# EAGLE design odroid_shield (EAGLE 6.5.0)
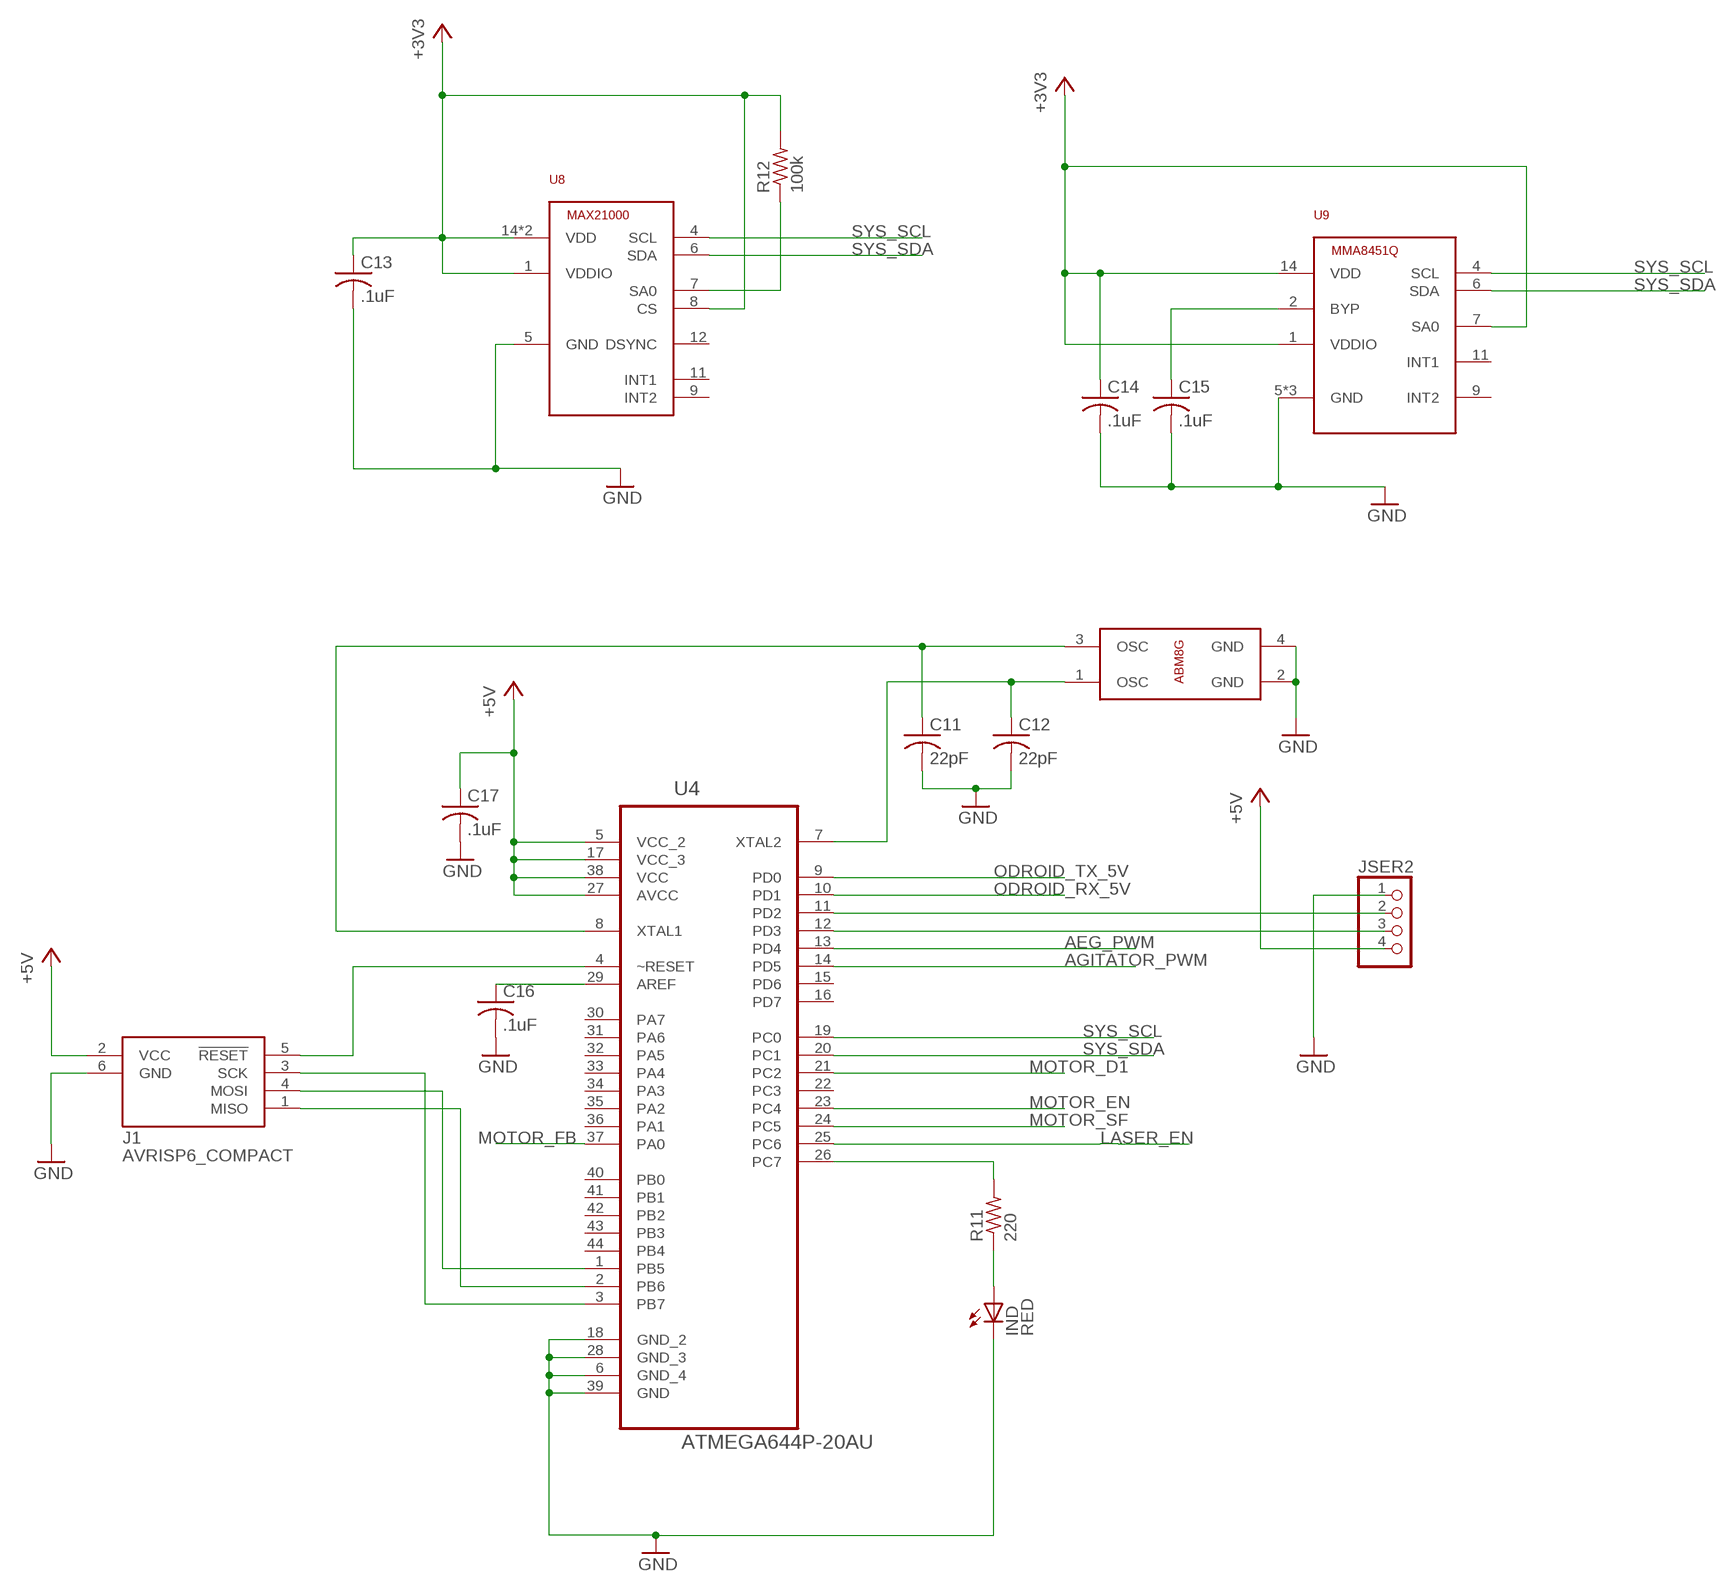
[diagram p0: schematic, sheet 1, part 1 of 2]
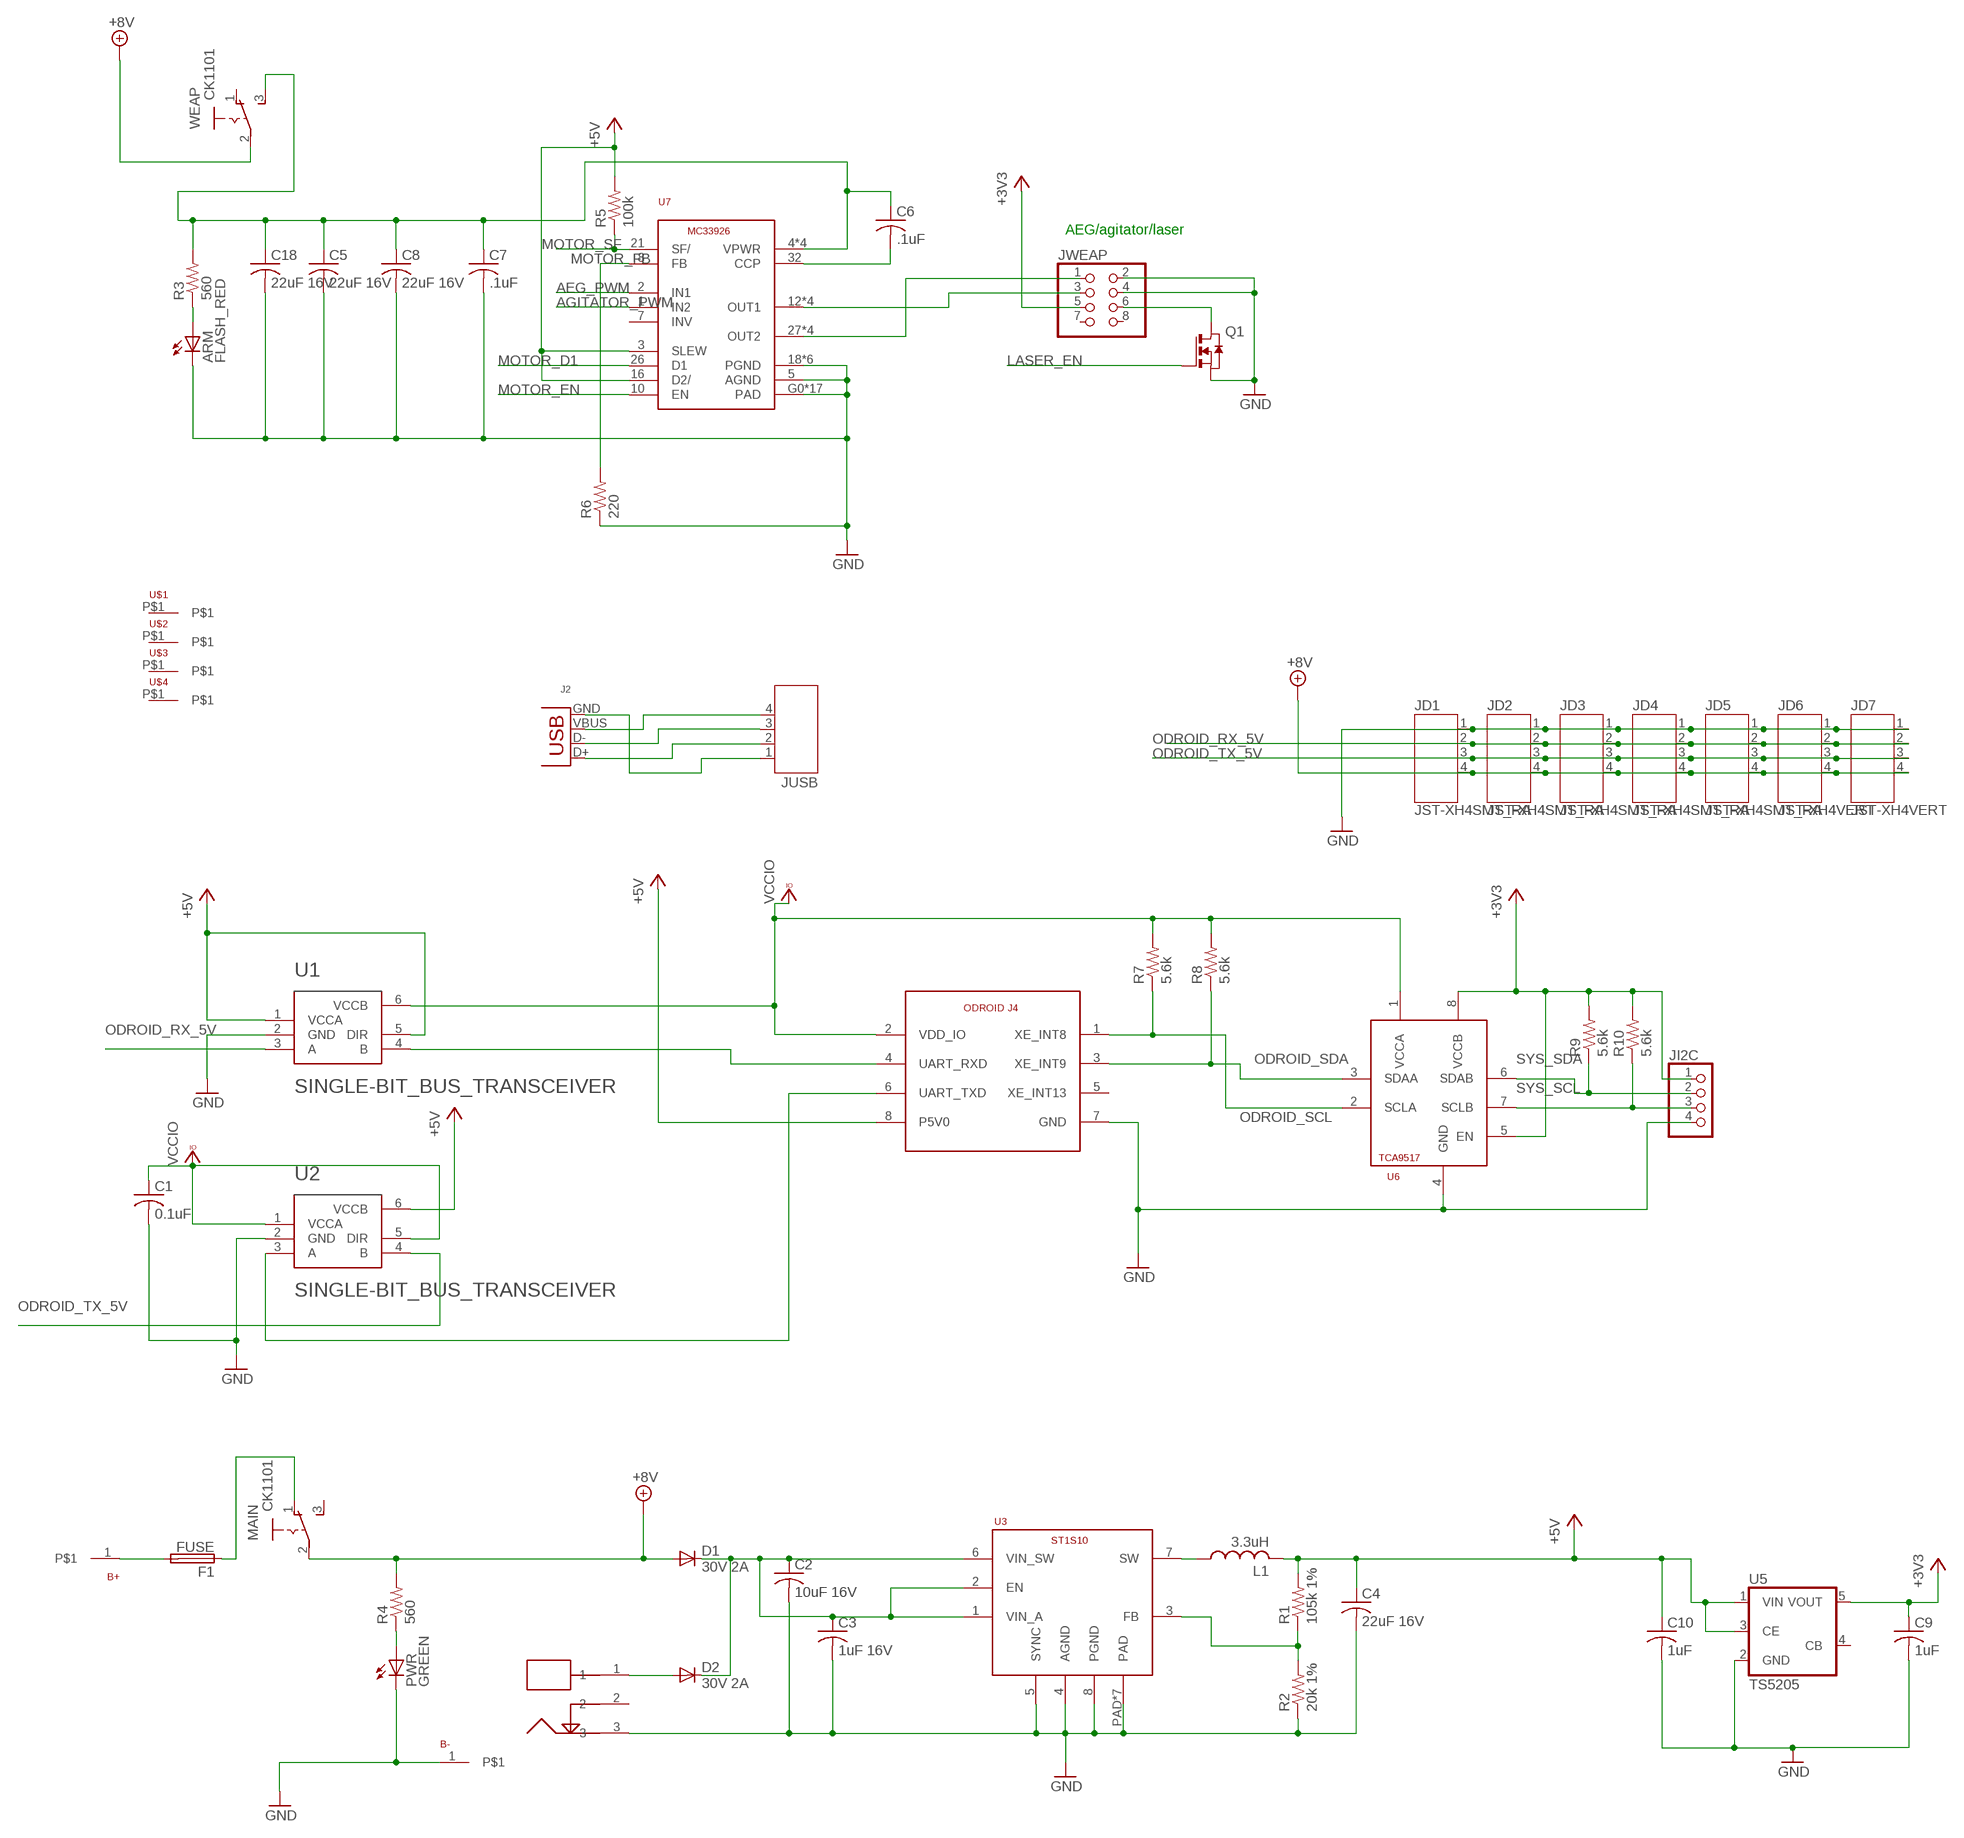
[diagram p1: schematic, sheet 1, part 2 of 2]

## Parts
ARM  FLASH_RED  LED5MM  [LED5MM]
B+  BAT_TERM  [BAT_TERM]
B-  BAT_TERM  [BAT_TERM]
C1  0.1uF  C-USC0603  [C0603]
C2  10uF 16V  C-USC1206  [C1206]
C3  1uF 16V  C-USC0603  [C0603]
C4  22uF 16V  C-USC1210  [C1210]
C5  22uF 16V  C-USC1210  [C1210]
C6  .1uF  C-USC0603  [C0603]
C7  .1uF  C-USC0603  [C0603]
C8  22uF 16V  C-USC1210  [C1210]
C9  1uF  C-USC0603  [C0603]
C10  1uF  C-USC0603  [C0603]
C11  22pF  C-USC0603  [C0603]
C12  22pF  C-USC0603  [C0603]
C13  .1uF  C-USC0603  [C0603]
C14  .1uF  C-USC0603  [C0603]
C15  .1uF  C-USC0603  [C0603]
C16  .1uF  C-USC0603  [C0603]
C17  .1uF  C-USC0603  [C0603]
C18  22uF 16V  C-USC1210  [C1210]
D1  30V 2A  DIODE-CMS06  [CMS06]
D2  30V 2A  DIODE-CMS06  [CMS06]
F1  FUSE  [KEYSTONE_HORIZ_FUSE_CLIP]
IND  RED  LEDCHIPLED_0805  [CHIPLED_0805]
J1  AVRISP6_COMPACT  [CON6P2R]
J2  USB2MM  [1X04/2MM]
J4  ODROID_J4  [2X04/2MM]
JD1  JST-XH4SMT_RA  [JST_XH_SMT_RA_4]
JD2  JST-XH4SMT_RA  [JST_XH_SMT_RA_4]
JD3  JST-XH4SMT_RA  [JST_XH_SMT_RA_4]
JD4  JST-XH4SMT_RA  [JST_XH_SMT_RA_4]
JD5  JST-XH4SMT_RA  [JST_XH_SMT_RA_4]
JD6  JST-XH4VERT  [JST_XH_VERT_4]
JD7  JST-XH4VERT  [JST_XH_VERT_4]
JI2C  PINHD-1X4  [1X04]
JSER2  PINHD-1X4  [1X04]
JUSB  JST-PH4  [JST-PH4]
JWEAP  PINHD-2X4  [2X04]
L1  3.3uH  L-USWURTH_74404042033  [WURTH_74404042033]
MAIN  CK1101  [CK1101C]
PWR  GREEN  LEDCHIPLED_0805  [CHIPLED_0805]
Q1  NMOSSOT23  [SOT-23]
R1  105k 1%  R-US_R0603  [R0603]
R2  20k 1%  R-US_R0603  [R0603]
R3  560  R-US_R0603  [R0603]
R4  560  R-US_R0603  [R0603]
R5  100k  R-US_R0603  [R0603]
R6  220  R-US_R0603  [R0603]
R7  5.6k  R-US_R0603  [R0603]
R8  5.6k  R-US_R0603  [R0603]
R9  5.6k  R-US_R0603  [R0603]
R10  5.6k  R-US_R0603  [R0603]
R11  220  R-US_R0603  [R0603]
R12  100k  R-US_R0603  [R0603]
SHORE  PJ-034ASMT  [CUI_PJ_015AH_SMT]
U1  SINGLE-BIT_BUS_TRANSCEIVER  [SOT23-6]
U2  SINGLE-BIT_BUS_TRANSCEIVER  [SOT23-6]
U3  ST1S10  [POWER_SO8]
U4  ATMEGA644P-20AU  [QFP80P1200X1200X120-44N]
U5  TS5205  [SOT25]
U6  TCA9517MSOP8  [MSOP8]
U7  MC33926  [PQFN32]
U8  MAX21000  [LGA16]
U9  MMA8451Q  [QFN16]
U10  ABM8G  [ABM8G]
U$1  M3_HEX_MOUNT  [M3_HEX_MOUNT]
U$2  M3_HEX_MOUNT  [M3_HEX_MOUNT]
U$3  M3_HEX_MOUNT  [M3_HEX_MOUNT]
U$4  M3_HEX_MOUNT  [M3_HEX_MOUNT]
WEAP  CK1101  [CK1101C]

## Nets
+3V3: C9.1 C13.1 C14.1 JI2C.1 JWEAP.5 R9.2 R10.2 R12.2 U5.5(VOUT) U6.5(EN) U6.8(VCCB) U8.1(VDDIO) U8.8(CS) U8.14(VDD) U8.15(VDD) U9.1(VDDIO) U9.7(SA0) U9.14(VDD)
+5V: C4.1 C10.1 C17.1 J1.2(VCC) J4.8(P5V0) JSER2.4 L1.2 R1.2 R5.2 U1.1(VCCA) U1.5(DIR) U2.6(VCCB) U4.5(VCC_2) U4.17(VCC_3) U4.27(AVCC) U4.38(VCC) U5.1(VIN) U5.3(CE) U7.3(SLEW) U7.16(D2/)
+8V: D1.1(A) JD1.4 JD2.4 JD3.4 JD4.4 JD5.4 JD6.4 JD7.4 MAIN.2(P) R4.2 WEAP.2(P)
AEG_PWM: U4.13(PD4) U7.2(IN1)
AGITATOR_PWM: U4.14(PD5) U7.1(IN2)
GND: ARM.K(C) B-.1 C1.2 C2.2 C3.2 C4.2 C5.2 C7.2 C8.2 C9.2 C10.2 C11.2 C12.2 C13.2 C14.2 C15.2 C16.2 C17.2 C18.2 IND.C J1.6(GND) J4.7(GND) JD1.1 JD2.1 JD3.1 JD4.1 JD5.1 JD6.1 JD7.1 JI2C.4 JSER2.1 JWEAP.2 JWEAP.4 PWR.C Q1.2(S) R2.1 R6.1 SHORE.3 U1.2(GND) U2.2(GND) U3.4(AGND) U3.5(SYNC) U3.8(PGND) U3.PAD U3.PAD1(PAD) U3.PAD2(PAD) U3.PAD3(PAD) U3.PAD4(PAD) U3.PAD5(PAD) U3.PAD6(PAD) U4.6(GND_4) U4.18(GND_2) U4.28(GND_3) U4.39(GND) U5.2(GND) U6.4(GND) U7.5(AGND) U7.18(PGND) U7.19(PGND) U7.20(PGND) U7.22(PGND) U7.23(PGND) U7.24(PGND) U7.G0(PAD) U7.G1(PAD) U7.G2(PAD) U7.G3(PAD) U7.G4(PAD) U7.G5(PAD) U7.G6(PAD) U7.G7(PAD) U7.G8(PAD) U7.G9(PAD) U7.G10(PAD) U7.G11(PAD) U7.G12(PAD) U7.G13(PAD) U7.G14(PAD) U7.G15(PAD) U7.G16(PAD) U8.5(GND) U9.5(GND) U9.10(GND) U9.12(GND) U10.2(GND) U10.4(GND)
LASER_EN: Q1.3(G) U4.25(PC6)
MOTOR_D1: U4.21(PC2) U7.26(D1)
MOTOR_EN: U4.23(PC4) U7.10(EN)
MOTOR_FB: R6.2 U4.37(PA0) U7.8(FB)
MOTOR_SF: R5.1 U4.24(PC5) U7.21(SF/)
N$1: J2.VBUS JUSB.4
N$2: J4.4(UART_RXD) U1.4(B)
N$3: J2.D- JUSB.3
N$4: J4.6(UART_TXD) U2.3(A)
N$5: J2.D+ JUSB.2
N$6: J2.GND JUSB.1
N$7: B+.1 F1.3 F1.4
N$8: F1.1 F1.2 MAIN.1(O)
N$9: D2.1(A) SHORE.1
N$10: L1.1 U3.7(SW)
N$11: C2.1 C3.1 D1.2(C) D2.2(C) U3.1(VIN_A) U3.2(EN) U3.6(VIN_SW)
N$12: JWEAP.1 U7.27(OUT2) U7.28(OUT2) U7.29(OUT2) U7.30(OUT2)
N$13: R1.1 R2.2 U3.3(FB)
N$14: JWEAP.3 U7.12(OUT1) U7.13(OUT1) U7.14(OUT1) U7.15(OUT1)
N$15: C5.1 C6.1 C7.1 C8.1 C18.1 R3.2 U7.4(VPWR) U7.6(VPWR) U7.11(VPWR) U7.31(VPWR) WEAP.3(S)
N$16: C6.2 U7.32(CCP)
N$17: R11.2 U4.26(PC7)
N$18: R12.1 U8.7(SA0)
N$19: JWEAP.6 Q1.1(D)
N$20: ARM.A R3.1
N$21: J1.5(!RESET) U4.4(~RESET)
N$22: PWR.A R4.1
N$23: J1.3(SCK) U4.3(PB7)
N$24: J1.4(MOSI) U4.1(PB5)
N$25: J1.1(MISO) U4.2(PB6)
N$26: JSER2.3 U4.12(PD3)
N$27: JSER2.2 U4.11(PD2)
N$28: IND.A R11.1
N$30: C16.1 U4.29(AREF)
N$32: C12.1 U4.7(XTAL2) U10.1(OSC)
N$33: C11.1 U4.8(XTAL1) U10.3(OSC)
N$36: C15.1 U9.2(BYP)
ODROID_RX_5V: JD1.2 JD2.2 JD3.2 JD4.2 JD5.2 JD6.2 JD7.2 U1.3(A) U4.10(PD1)
ODROID_SCL: J4.1(XE_INT8) R7.1 U6.2(SCLA)
ODROID_SDA: J4.3(XE_INT9) R8.1 U6.3(SDAA)
ODROID_TX_5V: JD1.3 JD2.3 JD3.3 JD4.3 JD5.3 JD6.3 JD7.3 U2.4(B) U4.9(PD0)
SYS_SCL: JI2C.3 R10.1 U4.19(PC0) U6.7(SCLB) U8.4(SCL) U9.4(SCL)
SYS_SDA: JI2C.2 R9.1 U4.20(PC1) U6.6(SDAB) U8.6(SDA) U9.6(SDA)
VCCIO: C1.1 J4.2(VDD_IO) R7.2 R8.2 U1.6(VCCB) U2.1(VCCA) U2.5(DIR) U6.1(VCCA)
Unconnected: J4.5(XE_INT13) JWEAP.7 JWEAP.8 MAIN.3(S) SHORE.2 U4.15(PD6) U4.16(PD7) U4.22(PC3) U4.30(PA7) U4.31(PA6) U4.32(PA5) U4.33(PA4) U4.34(PA3) U4.35(PA2) U4.36(PA1) U4.40(PB0) U4.41(PB1) U4.42(PB2) U4.43(PB3) U4.44(PB4) U5.4(CB) U7.7(INV) U8.9(INT2) U8.11(INT1) U8.12(DSYNC) U9.9(INT2) U9.11(INT1) U$1.P$1 U$2.P$1 U$3.P$1 U$4.P$1 WEAP.1(O)

## Notes on the sheet
- AEG/agitator/laser

## Library data of the parts
ARM = led:LED: LED OSRAM: - CHIPLED LG R971, LG N971, LY N971, LG Q971, LY Q971, LO R971, LY R971 LH N974, LH R974 LS Q976, LO Q976, LY Q976 LO Q996 - Hyper CHIPLED LW Q18S LB Q993, LB Q99A, LB R99A - SideLED LS A670, LO A670, LY A670, LG A670, LP A670 LB A673, LV A673, LT A673, LW A673 LH A674 LY A675 LS A676, LA A676, LO A676, LY A676, LW A676 LS A679, LY A679, LG A679 - Hyper Micro SIDELED® LS Y876, LA Y876, LO Y876, LY Y876 LT Y87S - SmartLED LW L88C, LW L88S LB L89C, LB L89S, LG L890 LS L89K, LO L89K, LY L89K LS L896, LA L896, LO L896, LY L896 - TOPLED LS T670, LO T670, LY T670, LG T670, LP T670 LSG T670, LSP T670, LSY T670, LOP T670, LYG T670 LG T671, LOG T671, LSG T671 LB T673, LV T673, LT T673, LW T673 LH T674 LS T676, LA T676, LO T676, LY T676, LB T676, LH T676, LSB T676, LW T676 LB T67C, LV T67C, LT T67C, LS T67K, LO T67K, LY T67K, LW E67C LS E67B, LA E67B, LO E67B, LY E67B, LB E67C, LV E67C, LT E67C LW T67C LS T679, LY T679, LG T679 LS T770, LO T770, LY T770, LG T770, LP T770 LB T773, LV T773, LT T773, LW T773 LH T774 LS E675, LA E675, LY E675, LS T675 LS T776, LA T776, LO T776, LY T776, LB T776 LHGB T686 LT T68C, LB T68C - Hyper Mini TOPLED® LB M676 - Mini TOPLED Santana® LG M470 LS M47K, LO M47K, LY M47K Source: http://www.osram.convergy.de LUXEON: - LUMILED® LXK2-PW12-R00, LXK2-PW12-S00, LXK2-PW14-U00, LXK2-PW14-V00 LXK2-PM12-R00, LXK2-PM12-S00, LXK2-PM14-U00 LXK2-PE12-Q00, LXK2-PE12-R00, LXK2-PE12-S00, LXK2-PE14-T00, LXK2-PE14-U00 LXK2-PB12-K00, LXK2-PB12-L00, LXK2-PB12-M00, LXK2-PB14-N00, LXK2-PB14-P00, LXK2-PB14-Q00 LXK2-PR12-L00, LXK2-PR12-M00, LXK2-PR14-Q00, LXK2-PR14-R00 LXK2-PD12-Q00, LXK2-PD12-R00, LXK2-PD12-S00 LXK2-PH12-R00, LXK2-PH12-S00 LXK2-PL12-P00, LXK2-PL12-Q00, LXK2-PL12-R00 Source: www.luxeon.com KINGBRIGHT: KA-3528ASYC Source: www.kingbright.com; DPN: 67-1499-ND
B+ B- = odroid_shield:BAT_TERM
C1 C6 C7 C9-C17 = rcl:C-US: CAPACITOR, American symbol
C2 = rcl:C-US: CAPACITOR, American symbol; DPN: 399-7442-1-ND
C3 = rcl:C-US: CAPACITOR, American symbol; DPN: 399-7847-1-ND
C4 C5 C8 C18 = rcl:C-US: CAPACITOR, American symbol; DPN: 445-3955-1-ND
D1 D2 = odroid_shield:DIODE-: DIODE; DPN: CMS06QMCT-ND
F1 = odroid_shield:FUSE: Fuse; DPN: 36-3569-ND
IND PWR = led:LED: LED OSRAM: - CHIPLED LG R971, LG N971, LY N971, LG Q971, LY Q971, LO R971, LY R971 LH N974, LH R974 LS Q976, LO Q976, LY Q976 LO Q996 - Hyper CHIPLED LW Q18S LB Q993, LB Q99A, LB R99A - SideLED LS A670, LO A670, LY A670, LG A670, LP A670 LB A673, LV A673, LT A673, LW A673 LH A674 LY A675 LS A676, LA A676, LO A676, LY A676, LW A676 LS A679, LY A679, LG A679 - Hyper Micro SIDELED® LS Y876, LA Y876, LO Y876, LY Y876 LT Y87S - SmartLED LW L88C, LW L88S LB L89C, LB L89S, LG L890 LS L89K, LO L89K, LY L89K LS L896, LA L896, LO L896, LY L896 - TOPLED LS T670, LO T670, LY T670, LG T670, LP T670 LSG T670, LSP T670, LSY T670, LOP T670, LYG T670 LG T671, LOG T671, LSG T671 LB T673, LV T673, LT T673, LW T673 LH T674 LS T676, LA T676, LO T676, LY T676, LB T676, LH T676, LSB T676, LW T676 LB T67C, LV T67C, LT T67C, LS T67K, LO T67K, LY T67K, LW E67C LS E67B, LA E67B, LO E67B, LY E67B, LB E67C, LV E67C, LT E67C LW T67C LS T679, LY T679, LG T679 LS T770, LO T770, LY T770, LG T770, LP T770 LB T773, LV T773, LT T773, LW T773 LH T774 LS E675, LA E675, LY E675, LS T675 LS T776, LA T776, LO T776, LY T776, LB T776 LHGB T686 LT T68C, LB T68C - Hyper Mini TOPLED® LB M676 - Mini TOPLED Santana® LG M470 LS M47K, LO M47K, LY M47K Source: http://www.osram.convergy.de LUXEON: - LUMILED® LXK2-PW12-R00, LXK2-PW12-S00, LXK2-PW14-U00, LXK2-PW14-V00 LXK2-PM12-R00, LXK2-PM12-S00, LXK2-PM14-U00 LXK2-PE12-Q00, LXK2-PE12-R00, LXK2-PE12-S00, LXK2-PE14-T00, LXK2-PE14-U00 LXK2-PB12-K00, LXK2-PB12-L00, LXK2-PB12-M00, LXK2-PB14-N00, LXK2-PB14-P00, LXK2-PB14-Q00 LXK2-PR12-L00, LXK2-PR12-M00, LXK2-PR14-Q00, LXK2-PR14-R00 LXK2-PD12-Q00, LXK2-PD12-R00, LXK2-PD12-S00 LXK2-PH12-R00, LXK2-PH12-S00 LXK2-PL12-P00, LXK2-PL12-Q00, LXK2-PL12-R00 Source: www.luxeon.com KINGBRIGHT: KA-3528ASYC Source: www.kingbright.com
J1 = odroid_shield:AVRISP6: 6-pin dual-row connector for Atmel AVRISP programmer interface
J2 = odroid_shield:USB: USB Connectors
J4 = odroid_shield:ODROID_J4
JD1-JD5 = odroid_shield:JST-XH4; DPN: S9490-ND
JD6 JD7 = odroid_shield:JST-XH4; DPN: 455-2249-ND
JI2C = pinhead:PINHD-1X4: PIN HEADER
JSER2 = pinhead:PINHD-1X4: PIN HEADER; DPN: S9410-ND
JUSB = odroid_shield:JST-PH4
JWEAP = pinhead:PINHD-2X4: PIN HEADER
L1 = odroid_shield:L-US: INDUCTOR, American symbol; DPN: 732-5505-1-ND
MAIN = odroid_shield:CK1101; DPN: CKN5001-ND; PRICE1: 3.85; PRICE10: 3.689
Q1 = zetex:NMOSSOT23: MOS FET; OC_FARNELL: unknown; OC_NEWARK: unknown
R1-R12 = rcl:R-US_: RESISTOR, American symbol
SHORE = odroid_shield:PJ-034A; DPN: CP-015AHPJ-CT-ND
U1 U2 = odroid_shield:SINGLE-BIT_BUS_TRANSCEIVER: Texas Instruments single-bit, dual supply bus transceiver; DPN: 296-16843-1-ND
U3 = odroid_shield:ST1S10
U4 = odroid_shield:ATMEGA644P-20AU: 8-bit Microcontroller with Bytes In-System Programmable Flash; MPN: ATMEGA644P-20AU; OC_FARNELL: 1455121; OC_NEWARK: 58M3746; PACKAGE: TQFP-44; SUPPLIER: Atmel
U5 = v-reg:TS5205: 150mA Low Noise LDO Voltage Regulator with Enable TSC [Taiwan Semiconductor Company, Ltd] Source: http://www.taiwansemi.com .. 5205_0409c.pdf
U6 = odroid_shield:TCA9517
U7 = odroid_shield:MC33926; DPN: MC33926PNB-ND
U8 = odroid_shield:MAX21000
U9 = odroid_shield:MMA8451Q
U10 = odroid_shield:ABM8G; DPN: 535-10267-6-ND
U$1-U$4 = odroid_shield:M3_HEX_MOUNT
WEAP = odroid_shield:CK1101; DPN: CKN5001-ND

## Board
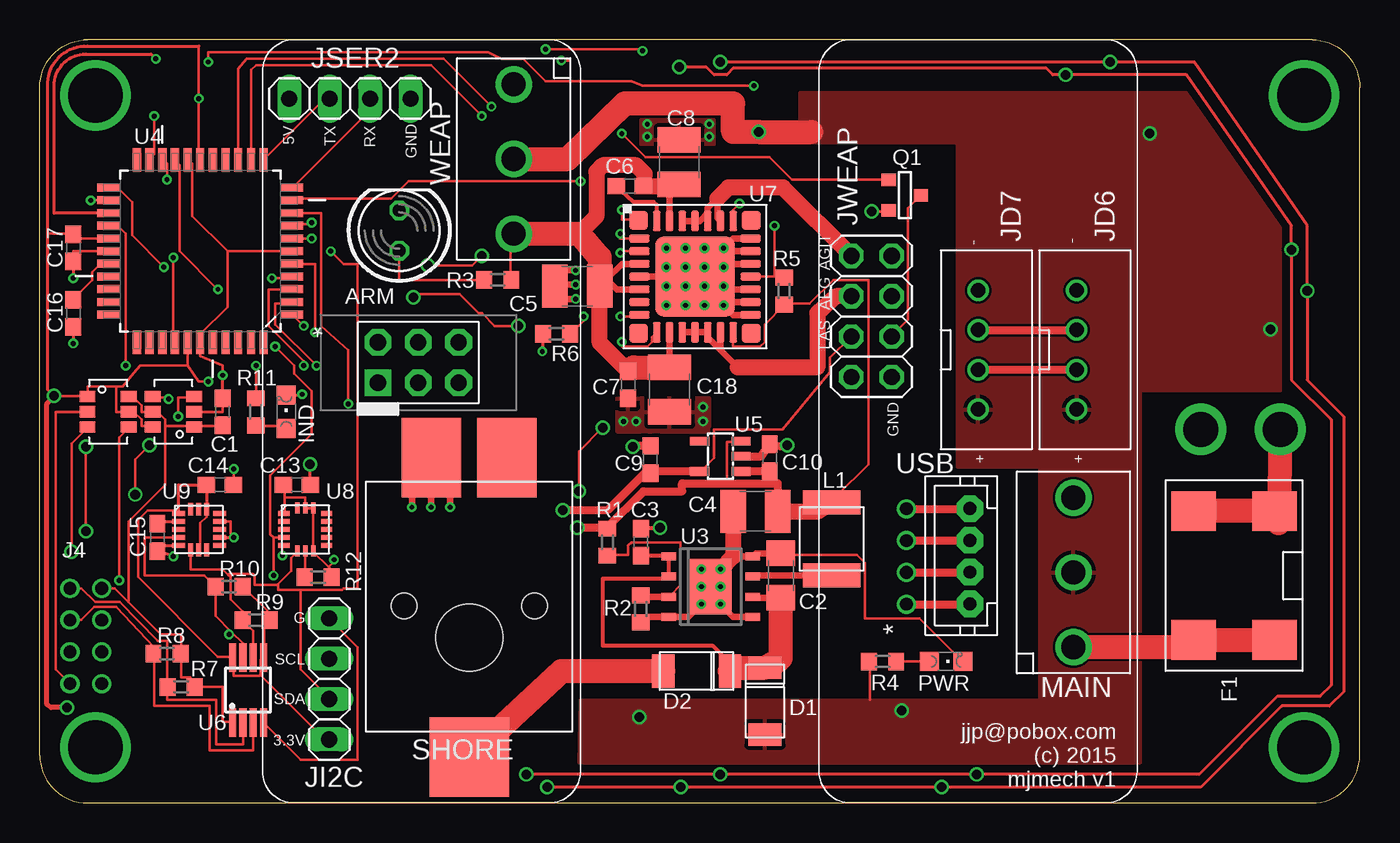
[diagram p2: board, top side]
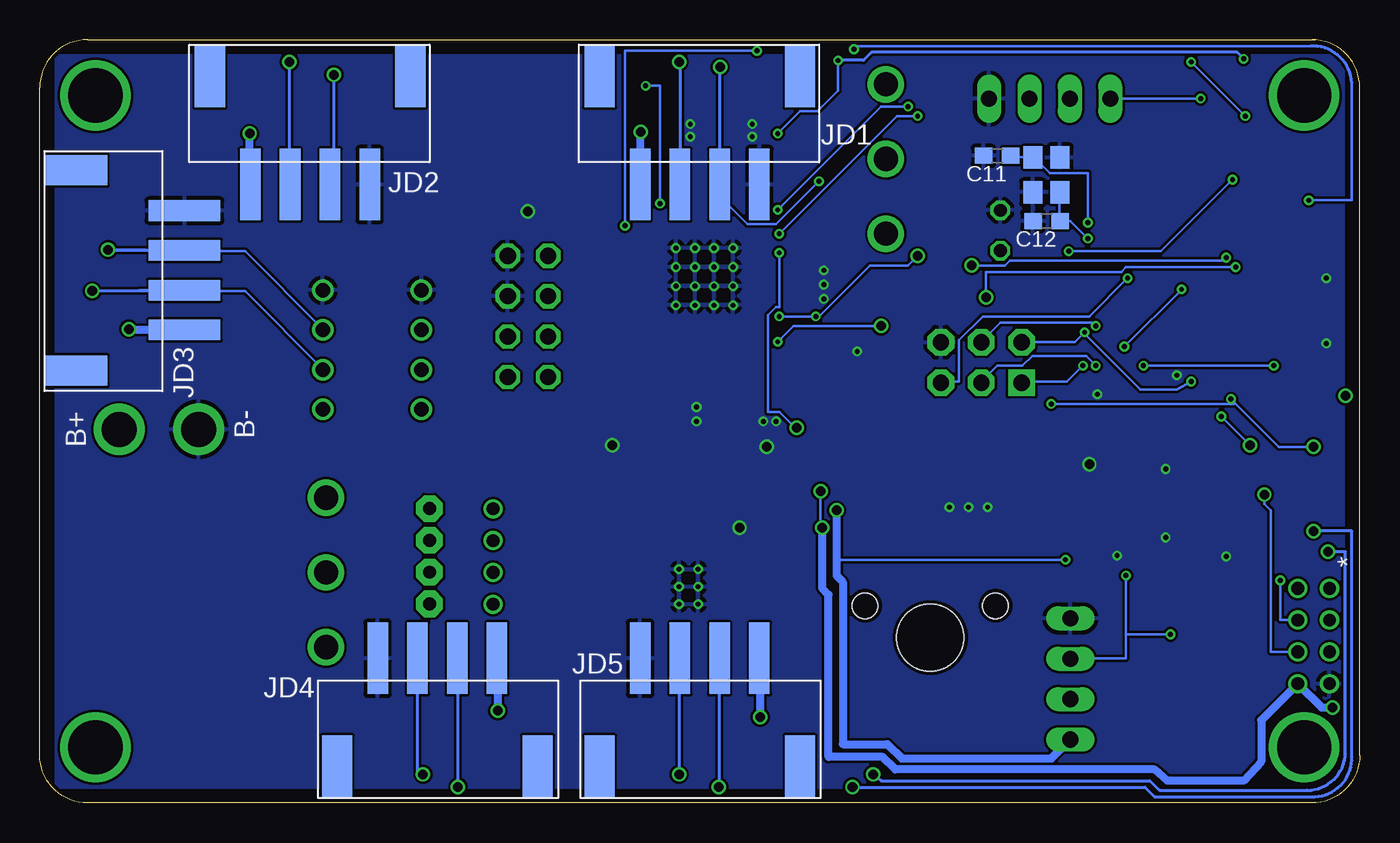
[diagram p3: board, bottom side, seen from below]

Size 83 x 48 mm. Coordinates in mm from the lower left corner, seen from the top.
Outline: 80,0 3,0 arc-90 0,3 0,45 arc-90 3,48
Outline: 80,0 80.1,0
Outline: 2.8,48 80,48 arc-90 83,45 83,3 arc-90 80,0
Copper layers (1*16): Top 0.035mm / dielectric 0.2mm / Bottom 0.035mm
Design rules "MF_2_Layer": minimum track width 6mil, minimum drill 12mil, track to track 6mil, track to pad 6mil, pad to pad 6mil, via to via 6mil, smd to smd 0mil, copper to edge 10mil, drill to drill 10mil, minimum pad ring 6mil, minimum via ring 6mil, stop-mask expansion 2mil, vias tented up to drill 25mil, thermal gap 10mil

### Footprints (pad centres in the part's own frame; a part is rotated, then mirrored left to right if it is on the bottom)
LED5MM = drill 0.813 octagon: A -1.27,0; K 1.27,0
BAT_TERM = drill 2.2: 1 0,0
C0603 = smd 1.1 x 1: 1 -0.85,0; 2 0.85,0
C1206 = smd 1.6 x 1.8: 1 -1.4,0; 2 1.4,0
C1210 = smd 1.6 x 2.7: 1 -1.4,0; 2 1.4,0
CMS06 = smd 1.4 x 2.1: 1 -2.1,0; 2 2.1,0
KEYSTONE_HORIZ_FUSE_CLIP = smd 2.5 x 2.8: 1 -4.05,2.55; 2 -4.05,-2.55; 3 4.05,2.55; 4 4.05,-2.55
CHIPLED_0805 = smd 1.2 x 1.2: A 0,-1.05; C 0,1.05
CON6P2R = drill 1.016 pad 1.676 square: 1 -2.54,-1.27 | drill 1.016 pad 1.676 octagon: 2 -2.54,1.27; 3 0,-1.27; 4 0,1.27; 5 2.54,-1.27; 6 2.54,1.27
1X04/2MM = drill 0.8: D+ 1,0; D- -1,0; GND 3,0; VBUS -3,0
2X04/2MM = drill 0.8: 1 -3,1; 2 -3,-1; 3 -1,1; 4 -1,-1; 5 1,1; 6 1,-1; 7 3,1; 8 3,-1
JST_XH_SMT_RA_4 = smd 1.3 x 4.5: 1 -3.75,4.6; 2 -1.25,4.6; 3 1.25,4.6; 4 3.75,4.6 | smd 1.9 x 3.9: SHLD1 -6.3,-2.2; SHLD2 6.3,-2.2
JST_XH_VERT_4 = drill 0.9: 1 -3.75,0; 2 -1.25,0; 3 1.25,0; 4 3.75,0
1X04 = drill 1.016 long: 1 -3.81,0; 2 -1.27,0; 3 1.27,0; 4 3.81,0
JST-PH4 = drill 0.813 pad 1.676 octagon: 1 3.016,0; 2 1.016,0; 3 -0.984,0; 4 -2.984,0
2X04 = drill 1.016 octagon: 1 -3.81,-1.27; 2 -3.81,1.27; 3 -1.27,-1.27; 4 -1.27,1.27; 5 1.27,-1.27; 6 1.27,1.27; 7 3.81,-1.27; 8 3.81,1.27
WURTH_74404042033 = smd 1.5 x 3.6: 1 -2.3,0; 2 2.3,0
CK1101C = drill 1.524: 1 0,-4.699; 2 0,0; 3 0,4.699
SOT-23 = smd 0.787 x 0.889: 1 0.025,-1.016; 2 -0.94,1.016; 3 0.991,1.016
R0603 = smd 1 x 1.1: 1 -0.85,0; 2 0.85,0
CUI_PJ_015AH_SMT = smd 5 x 5: 1 0,7.5 | smd 3.75 x 5: 2 -2.375,-11.3; 3 2.375,-11.3 | hole 4.2: 0,0 | hole 1.6: 4.1,-2; -4.1,-2
SOT23-6 = smd 1 x 0.7: 1 -1.3,0.95; 2 -1.3,0; 3 -1.3,-0.95; 4 1.3,-0.95; 5 1.3,0; 6 1.3,0.95
POWER_SO8 = smd 0.5 x 0.9: 1 -1.905,-2.64; 2 -0.635,-2.64; 3 0.635,-2.64; 4 1.905,-2.64; 5 1.905,2.64; 6 0.635,2.64; 7 -0.635,2.64; 8 -1.905,2.64 | smd 3.5 x 2.6: PAD 0,0 | drill 0.305: PAD1 -1.1,0.6; PAD2 0,0.6; PAD3 1.1,0.6; PAD4 -1.1,-0.6; PAD5 0,-0.6; PAD6 1.1,-0.6
QFP80P1200X1200X120-44N = smd 1.473 x 0.508: 1 -5.74,3.988; 2 -5.74,3.2; 3 -5.74,2.388; 4 -5.74,1.6; 5 -5.74,0.787; 6 -5.74,0; 7 -5.74,-0.787; 8 -5.74,-1.6; 9 -5.74,-2.388; 10 -5.74,-3.2; 11 -5.74,-3.988; 23 5.74,-3.988; 24 5.74,-3.2; 25 5.74,-2.388; 26 5.74,-1.6; 27 5.74,-0.787; 28 5.74,0; 29 5.74,0.787; 30 5.74,1.6; 31 5.74,2.388; 32 5.74,3.2; 33 5.74,3.988 | smd 0.508 x 1.473: 12 -3.988,-5.74; 13 -3.2,-5.74; 14 -2.388,-5.74; 15 -1.6,-5.74; 16 -0.787,-5.74; 17 0,-5.74; 18 0.787,-5.74; 19 1.6,-5.74; 20 2.388,-5.74; 21 3.2,-5.74; 22 3.988,-5.74; 34 3.988,5.74; 35 3.2,5.74; 36 2.388,5.74; 37 1.6,5.74; 38 0.787,5.74; 39 0,5.74; 40 -0.787,5.74; 41 -1.6,5.74; 42 -2.388,5.74; 43 -3.2,5.74; 44 -3.988,5.74
SOT25 = smd 0.55 x 1.2: 1 -0.95,-1.3; 2 0,-1.3; 3 0.95,-1.3; 4 0.95,1.3; 5 -0.95,1.3
MSOP8 = smd 0.45 x 1.8: 1 -0.975,-2.05; 2 -0.325,-2.05; 3 0.325,-2.05; 4 0.975,-2.05; 5 0.975,2.05; 6 0.325,2.05; 7 -0.325,2.05; 8 -0.975,2.05
PQFN32 = smd 1.2 x 1.2: 1 -3.55,3.55; 9 -3.55,-3.55; 17 3.55,-3.55; 25 3.55,3.55 | smd 1.3 x 0.5: 2 -3.5,2.4; 3 -3.5,1.6; 4 -3.5,0.8; 5 -3.5,0; 6 -3.5,-0.8; 7 -3.5,-1.6; 8 -3.5,-2.4; 18 3.5,-2.4; 19 3.5,-1.6; 20 3.5,-0.8; 21 3.5,0; 22 3.5,0.8; 23 3.5,1.6; 24 3.5,2.4 | smd 0.5 x 1.3: 10 -2.4,-3.5; 11 -1.6,-3.5; 12 -0.8,-3.5; 13 0,-3.5; 14 0.8,-3.5; 15 1.6,-3.5; 16 2.4,-3.5; 26 2.4,3.5; 27 1.6,3.5; 28 0.8,3.5; 29 0,3.5; 30 -0.8,3.5; 31 -1.6,3.5; 32 -2.4,3.5 | smd 5 x 5: G0 0,0 | drill 0.305: G1 -1.8,1.8; G2 -0.6,1.8; G3 0.6,1.8; G4 1.8,1.8; G5 -1.8,0.6; G6 -0.6,0.6; G7 0.6,0.6; G8 1.8,0.6; G9 -1.8,-0.6; G10 -0.6,-0.6; G11 0.6,-0.6; G12 1.8,-0.6; G13 -1.8,-1.8; G14 -0.6,-1.8; G15 0.6,-1.8; G16 1.8,-1.8
LGA16 = smd 0.7 x 0.3: 1 -1.35,1; 2 -1.35,0.5; 3 -1.35,0; 4 -1.35,-0.5; 5 -1.35,-1; 9 1.35,-1; 10 1.35,-0.5; 11 1.35,0; 12 1.35,0.5; 13 1.35,1 | smd 0.3 x 0.7: 6 -0.5,-1.35; 7 0,-1.35; 8 0.5,-1.35; 14 0.5,1.35; 15 0,1.35; 16 -0.5,1.35
QFN16 = smd 0.813 x 0.305: 1 -1.275,1; 2 -1.275,0.5; 3 -1.275,0; 4 -1.275,-0.5; 5 -1.275,-1; 9 1.325,-1; 10 1.325,-0.5; 11 1.325,0; 12 1.325,0.5; 13 1.325,1 | smd 0.305 x 0.813: 6 -0.5,-1.275; 7 0,-1.275; 8 0.5,-1.275; 14 0.5,1.275; 15 0,1.275; 16 -0.5,1.275
ABM8G = smd 1.4 x 1.2: 1 -1.1,-0.85; 2 1.1,-0.85; 3 1.1,0.85; 4 -1.1,0.85
M3_HEX_MOUNT = drill 3.4: P$1 0,0

### Placement (x,y rotation side)
ARM  22.6,36 90 top
B+  78,23.5 0 bottom
B-  73,23.5 0 bottom
C1  11.5,24.6 90 top
C2  46.6,14.3 90 top
C3  37.8,16.4 90 top
C4  45,18.34 180 top
C5  33.8,32.5 180 top
C6  37.1,38.8 180 top
C7  37,26.3 270 top
C8  40.2,40.3 90 top
C9  38.4,21.6 90 top
C10  45.9,21.7 90 top
C11  22.8,40.7 180 bottom
C12  19.7,36.6 180 bottom
C13  16.16,20 0 top
C14  11.34,20 0 top
C15  7.4,16.7 270 top
C16  2.1,30.8 270 top
C17  2.1,34.9 270 top
C18  39.6,26 270 top
D1  45.6,6.4 90 top
D2  41.3,8.3 0 top
F1  75.1,14.3 90 top
IND  15.5,24.6 0 top
J1  23.8,27.7 0 top
J2  54.5,15.5 90 top
J4  2.9,10.5 270 bottom
JD1  41.5,43.5 180 bottom
JD2  66,43.5 180 bottom
JD3  78.5,33.5 270 bottom
JD4  58,4.5 0 bottom
JD5  41.5,4.5 0 bottom
JD6  65.2,28.5 270 top
JD7  59,28.5 270 top
JI2C  18.2,7.8 90 top
JSER2  19.5,44.3 180 top
JUSB  58.5,15.5 90 top
JWEAP  52.3,30.6 270 top
L1  49.8,16.6 90 top
MAIN  65,14.5 0 top
PWR  57,8.9 270 top
Q1  54.4,38.2 90 top
R1  35.7,16.4 90 top
R2  37.8,12.2 90 top
R3  28.8,32.9 0 top
R4  53,8.9 180 top
R5  46.8,32.2 270 top
R6  32.5,29.5 0 top
R7  8.9,7.3 0 top
R8  8,9.4 0 top
R9  13.6,11.5 0 top
R10  11.9,13.6 0 top
R11  13.6,24.6 90 top
R12  17.5,14.2 0 top
SHORE  27,10.4 180 top
U1  4.3,24.6 0 top
U2  8.4,24.6 180 top
U3  42.2,13.6 270 top
U4  10.1,34.7 180 top
U5  42.8,21.8 90 top
U6  13.1,7.1 0 top
U7  41.2,33.1 0 top
U8  16.7,17.2 0 top
U9  10,17.2 0 top
U10  19.7,39.5 90 bottom
U$1  3.5,3.5 0 top
U$2  79.5,3.5 0 top
U$3  3.5,44.5 0 top
U$4  79.5,44.5 0 top
WEAP  29.8,40.5 180 top

### Tracks (layer width: path | path; a pad name or v marks a point on that pad's centre or on a via)
+3V3  (via drill 0.3, 0.6)
  Top 0.152: R10.2 12.8,13.6 14.3,12.1 14.3,11.5 R9.2 14.4,11.5 14.1,11.2 14.1,9.2 U6.5 14,9.1 13.9,9 13.9,8.1 13.85,8.05 | U9.14 10.5,18 10.1,17.6 10.1,16.1 10,16 U9.7 | 8.72,18.4 6.8,18.4 6.2,17.8 6.2,14.2 11.2,9.2 12.1,9.2 U6.8 12.2,9.1 12.2,8 13.8,8 13.85,8.05 | 15.4,19.2 15.4,20 C13.1 | 15.4,19.2 15.4,18.2 U8.1 | 18.15,14.85 18.3,14.7 18.3,14.2 R12.2 | 18.15,14.85 17.2,15.8 U8.8 U8.14 | 15.4,19.2 16.7,19.2 U8.15 | JWEAP.5 49.7,28 49.7,27.1 46.7,23.5 42.4,23.5 42.4,21.7 41.7,21 U5.5 | 18.15,14.85 18.5,15.2 v18.5,15.3 | 13.85,8.05 17.9,4 JI2C.1
  Top 0.2: U9.14 C14.1 8.72,20 8.72,18.4 U9.1 | U8.15 U8.14
  Top 0.5: U5.5 38.5,20.85 C9.1 38.05,20.75 35.7,18.4 v32.9,18.4
  Bottom 0.152: 32.9,15.3 v18.5,15.3
  Bottom 0.5: v32.9,18.4 32.9,15.3 32.9,14.3 32.5,13.9 32.5,3.7 29.7,3.7 28.8,2.8 19.39,2.8 JI2C.1
+5V  (via drill 0.3, 0.6)
  Top 0.152: v17.3,29.6 17.3,33.9 15.9,33.9 U4.5 | U7.16 43.6,28.7 45.3,28.7 45.6,29 45.6,30.1 46.8,31.3 R5.2 46.8,31.4 48.4,31.4 49.9,32.9 52.1,32.9 52.1,21.3 50.1,19.3 L1.2 | U2.6 7.1,23.7 6.4,23.7 6.4,24.1 5.9,24.6 U1.5 4.8,24.6 4.8,26.2 | v0.9,25.6 3,25.6 | 0.5,35.8 2.1,35.8 C17.1 2.1,35.5 4.3,35.5 U4.27 | 43.2,20.1 43.2,22.7 44.1,22.7 U5.3 | U7.3 36.5,34.7 v36.5,34.6 | 9.3,27.5 6.3,27.5 5.91,27.03 5.2,26.2 4.8,26.2 | 9.3,27.5 9.3,28.9 U4.38 | 4.8,26.2 3,26.2 3,25.6 | 3,25.6 U1.1 | 10,47.6 v10,44.3 10,40.6 10.1,40.5 U4.17 | v10.6,26.5 10,26.5 9.3,27.5 | v33.9,19.6 33.9,22.1 v35.4,23.6
  Top 0.2: v0.9,25.6 0.5,26 0.5,35.8 0.5,45.3 arc-90 3,47.6 10,47.6
  Top 0.3: v1.7,6 0.7,6 0.45,6.2 0.45,25.1 v0.9,25.6
  Top 0.4: C10.1 45.9,20.2
  Top 0.5: 35.65,17.3 R1.2 | 35.65,17.3 37.95,19.6 40.4,19.6 40.4,20.1 43.2,20.1 46.4,20.1 | 45.9,20.2 46.4,20.1 | 46.4,20.1 C4.1 | C10.1 U5.1 | 35.65,17.3 v33.8,17.3
  Top 1: C4.1 48.96,18.34 L1.2
  Bottom 0.152: J1.2 21.2,29 17.9,29 v17.3,29.6 17.3,29.5 13.8,26 11.5,26 v10.6,26.5 | v36.5,34.6 36.5,31.2 36.7,31.2 37.2,30.7 37.2,24.6 36.5,24.6 35.5,23.6 v35.4,23.6 | v33.8,17.3 33.9,17.5 v33.9,19.6 | v10,44.3 JSER2.4
  Bottom 0.5: v33.8,17.3 33.8,13.5 33.4,13.1 33.4,2.9 30,2.9 29.2,2.1 12.9,2.1 12.1,1.4 7.3,1.4 6.2,2.6 6.2,5.2 J4.8 2.4,6 v1.7,6
+8V  (via drill 0.6)
  Top 0.152: 52.2,6.5 52.2,8.9 R4.2
  Top 1.5: WEAP.2 33.2,40.5 36.8,44 43.6,44 43.6,42.2 v45.2,42.2 48.5,42.2
  Bottom 0.5: JD2.4 69.8,38.9 v69.8,42.1 | JD3.4 77.4,29.75 v77.4,29.8 | JD4.4 54.2,9.1 v54.2,5.8 | JD5.4 37.7,9.1 v37.7,5.4 | v45.2,42.2 45.25,42.15 JD1.4
  pour Top: 47.8,44.7 72.1,44.7 78,36.2 78,25.9 69.2,25.9 69.2,2.5 33.9,2.5 34,6.5 62.9,6.5 62.9,21.1 57.7,21.1 57.7,41.5 47.8,41.5
AEG_PWM  (via drill 0.3)
  Top 0.152: U4.13 13.3,46.1 13.6,46.4 24.6,46.4 v27.8,43.2 | U7.2 36.5,35.5 v36.5,35.8
  Bottom 0.152: v36.5,35.8 29.1,43.2 v27.8,43.2
AGITATOR_PWM  (via drill 0.3)
  Top 0.152: U4.14 12.49,46.19 13,46.8 25.4,46.8 v28.4,43.8 | v36.6,37.3 36.6,36.7 37.6,36.7 U7.1
  Bottom 0.152: v36.6,37.3 30.1,43.8 v28.4,43.8
GND  (via drill 0.3, 0.6)
  Top 0.152: U8.5 15.25,16.2 v15.26,15.56 | v12.2,21 12.19,20.95 C14.2 | U9.12 12,17.7 12,16.7 v12.2,16.7 | v52.3,37.2 53.3,37.2 Q1.2 | U1.2 1,24.6 1,8.4 J4.7 | U2.2 11.5,24.6 C1.2 | PWR.C 58,8.9 55.3,11.6 51.9,11.6 51.9,15.1 51.4,15.6 46.7,15.6 C2.2 | U4.28 2.1,34.7 C17.2 | v11.5,26.9 11.5,27.5 10.1,28.1 U4.39 10.1,29.5 11.8,31.2 11.8,34.7 | 11.8,34.7 U4.6 | 11.8,34.7 9.6,36.9 9.6,40.2 9.4,40.4 U4.18 | U6.4 14.1,5 16.4,2.7 20,2.7 20,9.8 JI2C.4 | U3.PAD5 U3.PAD | U7.G6 U7.G0
  Top 0.2: R6.1 31.6,29.45 v31.6,28.4 | v8.4,15.5 C15.2 7.55,16.2 U9.5 | C13.2 v17,21.3 | U9.10 12,16.7 12.1,16.7 arc90 v12.2,16.7 | IND.C 16.55,25.65 arc90 v16.5,25.7 | C16.2 v2.1,28.9 | C17.2 v2.1,33 | C1.2 v11.5,26.9
  Top 0.254: C3.2 37.85,17.3 v39,17.3
  Top 0.4: U3.PAD3 43.6,11.7 U3.5 | U3.PAD6 40.8,11.7 U3.4 38.15,11.7 R2.1 | U3.PAD1 43.6,15.51 U3.8 45.03,15.7 C2.2 | U7.5 38.8,33.1 U7.G9 | U7.18 43.6,30.7 U7.G16 43.2,31.5 U7.19 | U7.20 43.2,32.3 U7.G12 | U7.22 43.2,33.9 U7.G8 | U7.23 43.2,34.7 U7.G4 43.6,35.5 U7.24 | v25.8,18.6 25.8,20.52 SHORE.3 | v24.6,18.6 24.6,20.3 | v23.4,18.6 23.4,20.6 | v33.7,33.5 32.6,33.5 | v33.7,32.6 32.6,32.6 32.5,32.5 C5.2 | v33.7,31.7 32.4,31.7
  Top 0.5: U5.2 45.35,21.8 C10.2 46.55,22.45 v47,22.5 | C9.2 37.35,22.45 v37.3,22.4
  Top 1: C4.2 43.6,15.5 U3.PAD1
  other vias: 38.2,42.7 38.2,41.9 42.1,42.7 42.1,41.9 36.7,24 37.5,24 41.7,24 41.7,24.9
  pour Bottom: 1,47 82,47 82,1 1,1
  pour Top: 37.8,43 42.4,43 42.4,41.4 37.8,41.4
  pour Top: 36.3,25.5 42.1,25.5 42.1,23.3 36.3,23.3
LASER_EN  (via drill 0.3)
  Top 0.152: v36.6,42.1 38.1,40.6 45.9,40.6 47.3,39.2 53.3,39.2 Q1.3
  Top 0.2: U4.25 0.9,37.09 0.9,45.1 arc-90 2.9,47.1 7,47.1 v7.3,46.8 | v32.8,46.7 33.3,46.7
  Bottom 0.152: v36.6,42.1 35.2,43.5 34.1,43.5 32.8,44.8 v32.8,46.7
  Bottom 0.2: v7.3,46.8 7.7,47.2 30.7,47.2 31.2,46.7 v32.8,46.7
MOTOR_D1  (via drill 0.3)
  Top 0.152: U7.26 43.6,37.3 v44,37.7 | v44.9,45.1 37.9,45.1 37.2,45.4 31.8,45.4 30.4,46.8 29,46.8 28.2,47.2 10.6,47.2 v10.6,46.6 | v7.2,43.2 7.2,40.8 6.9,40.5 U4.21
  Bottom 0.152: v44,37.7 44,45.1 v44.9,45.1 | v10.6,46.6 v7.2,43.2
MOTOR_EN  (via drill 0.3, 0.6)
  Top 0.152: U7.10 38.5,29.3 38.5,29 38.2,28.7 36.6,28.7 v36.6,29 | v7.8,33.7 5.8,35.7 5.8,37.8 5,38.6 4.4,38.6 U4.23 | v30.1,30 28.6,30 27.8,30.8 27.6,30.8 26.4,32 23.7,32 v23.5,31.8
  Bottom 0.152: v36.6,29 35.6,30 v30.1,30 | v7.8,33.7 14.7,33.7 15,33.4 23.5,33.4 v23.5,31.8
MOTOR_FB  (via drill 0.3, 0.6)
  Top 0.152: v34.2,30.6 34.2,30.3 33.4,29.5 R6.2 | v36.5,30.6 37.7,30.6 U7.8 | v8.4,34.3 8.4,29 U4.37 | v24.4,33.8 27.2,33.8 v27.8,34.4
  Bottom 0.152: v36.5,30.6 v34.2,30.6 34,30.6 30.8,33.8 28.4,33.8 v27.8,34.4 | v8.4,34.3 8.6,34.1 22,34.1 22.3,33.8 v24.4,33.8
MOTOR_SF  (via drill 0.3)
  Top 0.152: U4.24 v3.2,37.9 | v31.8,47.4 37.8,47.4 v37.9,47.3 | U7.21 46.2,33.1 | 46.2,33.1 46.8,33.1 R5.1 | v46.2,36.3 46.2,33.1
  Bottom 0.152: v3.2,37.9 0.5,37.9 0.5,45.3 | 3.1,47.6 31.6,47.6 v31.8,47.4 | v46.2,36.3 46.2,47.3 v37.9,47.3
  Bottom 0.2: 0.5,45.3 arc-90 3.1,47.6
N$1
  Top 0.5: J2.VBUS 58.5,12.5 JUSB.4
N$2  (via drill 0.3)
  Top 0.152: v5,14 5,23 5.6,23.6 U1.4
  Bottom 0.152: v5,14 5,11.5 J4.4
N$3
  Top 0.5: J2.D- 58.5,14.5 JUSB.3
N$4  (via drill 0.3, 0.6)
  Top 0.152: v8.7,24.3 8.7,25.5 9.7,25.5 U2.3 | v6.9,22.5 6,21.6 v6,19.4
  Bottom 0.152: J4.6 5.6,9.5 5.6,18.4 6,18.8 v6,19.4 | v8.7,24.3 v6.9,22.5
N$5
  Top 0.5: J2.D+ 58.5,16.5 JUSB.2
N$6
  Top 0.5: J2.GND 58.5,18.5 JUSB.1
N$7
  Top 1.5: B+.1 77.9,17.6 F1.4 F1.3
N$8
  Top 1.5: MAIN.1 72,9.8 F1.1 F1.2
N$9
  Top 1.5: SHORE.1 32.8,8.3 D2.1
N$10
  Top 0.4: U3.7 44.91,14.3 L1.1
N$11
  Top 0.254: D2.2 43.4,8.8 42.3,9.9 35.4,9.9 35.4,14.1 39.42,14.1 U3.2 U3.1 39.52,15.55 C3.1
  Top 0.4: U3.6 44.91,12.9 C2.1
  Top 1.5: D2.2 43.6,8.5 D1.2 46.6,9.1 C2.1
N$12
  Top 0.4: U7.27 42.6,36.8 42.6,38 42,37.4 42,37.1 | U7.28 42,37.1 | 42,37.1 41.5,36.6 U7.29 U7.30
  Top 1: JWEAP.1 46.74,38.7 43.3,38.7 42.6,38
N$13
  Top 0.152: R1.1 35.7,15.6 37,15.6 37,16.2 37.2,16.4 40.3,16.4 40.3,13.7 39.7,13.1 U3.3
  Top 0.4: R2.2 37.88,12.96 U3.3
N$14
  Top 0.4: 43.9,27.4 42.8,28.5 | 42.8,28.5 U7.15 | 42.8,28.5 42,29.3 U7.14 U7.13 U7.12
  Top 1: JWEAP.3 50.07,31.87 48.9,30.8 48.9,27.4 43.9,27.4
N$15
  Top 0.152: R3.2 29.6,32.9 29.6,35.1 WEAP.3
  Top 0.4: C5.1 35.65,32.95 | 35.65,32.95 36.6,33.9 U7.4 | U7.6 36.3,32.3 35.65,32.95 | C18.1 U7.11 | U7.31 39.6,38.3 C8.1
  Top 1: C5.1 35.2,28.95 C7.1 37.35,27.4 | 33.9,35.8 35,36.9 35,39.7 35.4,40.1 37.5,40.1 38.05,39.55 C6.1 40.1,38.8 C8.1
  Top 1.5: WEAP.3 33.9,35.8 35.2,34.3 C5.1 | 37.35,27.4 C18.1
N$16
  Top 0.254: U7.32 38.8,37.6 38.6,37.8 37.35,37.8 C6.2
N$17  (via drill 0.3)
  Top 0.152: v13.6,27.5 R11.2 | v5.4,27.5 5.4,35.8 4.9,36.3 4.4,36.3 U4.26
  Bottom 0.152: v5.4,27.5 v13.6,27.5
N$18
  Top 0.152: U8.7 16.7,14.2 R12.1
N$19
  Top 0.152: Q1.1 55.4,38.2 54.6,37.4 54.6,30.4 53.6,29.4 JWEAP.6
N$20
  Top 0.152: R3.1 22.6,32.9 ARM.A
N$21  (via drill 0.3)
  Top 0.152: v14.6,33 15.8,33 U4.4
  Bottom 0.152: v14.6,33 17,30.6 23.7,30.6 25.2,29.1 25.2,26.5 26.3,26.5 J1.5
N$22
  Top 0.152: PWR.A R4.1
N$23  (via drill 0.3)
  Top 0.152: v16.6,27.5 16.6,27.8 14.4,30 14.4,32.3 15.8,32.3 U4.3
  Bottom 0.152: v16.6,27.5 17.2,28.1 20.6,28.1 21.2,27.5 22.8,27.5 23.8,26.5 J1.3
N$24  (via drill 0.3)
  Top 0.152: v16.6,30 15.9,30.7 U4.1
  Bottom 0.152: v16.6,30 16.8,30.2 22.6,30.2 23.8,29 J1.4
N$25  (via drill 0.3)
  Top 0.152: v17.4,27.5 14.8,30.1 14.8,31.4 15.8,31.4 U4.2
  Bottom 0.152: v17.4,27.5 18.4,26.5 21.2,26.5 J1.1
N$26
  Top 0.152: JSER2.3 17.9,44.3 14.1,40.5 U4.12
N$27
  Top 0.152: U4.11 15.9,38.7 20.7,43.5 20.7,44.3 JSER2.2
N$28
  Top 0.152: IND.A 15.5,23.7 13.6,23.7 R11.1
N$30
  Top 0.152: C16.1 2.1,31.7 3.3,32.9 3.3,33.4 3.8,33.9 4.3,33.9 U4.29
N$32  (via drill 0.3)
  Top 0.152: v17.1,35.5 15.9,35.5 U4.7
  Bottom 0.152: U10.1 18.9,38.4 18.9,36.6 C12.1 18.2,36.6 v17.1,35.5
N$33  (via drill 0.3)
  Top 0.152: v17.1,36.5 17.1,36.4 15.9,36.4 U4.8
  Bottom 0.152: C11.1 21.9,40.7 21.8,40.6 U10.3 20.5,40.6 19.5,39.6 17.1,39.6 v17.1,36.5
N$36
  Top 0.2: C15.1 7.55,17.7 U9.2
ODROID_RX_5V  (via drill 0.3, 0.6)
  Top 0.152: v2,15.8 2,22.6 3,23.6 U1.3 | v34,39.1 23.2,39.1 22.1,38 15.9,38 U4.10
  Top 0.203: v40.22,46.28 41.92,46.28 42.4,45.8 43.2,45.8 43.6,46.2 63.3,46.2 63.7,45.8 v64.5,45.8 72.1,45.8 78.7,36.3 v78.7,34.8 78.7,26.6 81.2,24.1 81.2,7.4 80.5,6.7 77.8,6.7 72.9,1.8 v58.9,1.8 v42.8,1.8 v30.6,1.8
  Top 0.5: JD7.2 JD6.2
  Bottom 0.152: v34,39.1 36.7,36.4 38.5,36.4 40.2,38.1 40.2,38.9 JD1.2 | JD6.2 65.2,29.8 70.1,34.7 73.9,34.7 JD3.2
  Bottom 0.203: JD2.2 64.5,38.9 v64.5,45.8 | v40.22,46.28 40.25,45.6 JD1.2 | v58.9,1.8 59.25,1.85 JD4.2 | JD5.2 42.8,9.05 v42.8,1.8 | v30.6,1.8 30.1,1.4 13.2,1.4 12.6,0.8 3.3,0.8 arc-88 0.9,3.1 0.9,15.8 v2,15.8 | JD3.2 78.7,34.75 v78.7,34.8 JD3.2
ODROID_SCL
  Top 0.152: J4.1 2.6,13.5 3.5,12.66 5.02,12.66 7.4,10.2 8,10.2 8,7.2 | 8,7.2 8,6.5 11.1,6.5 11.1,3.7 12.78,3.7 U6.2 | R7.1 8.05,7.25 8,7.2
ODROID_SDA
  Top 0.152: J4.3 2.6,11.5 3.42,12.34 4.82,12.34 7.2,9.8 7.2,9.5 | 7.2,9.5 7.2,6.1 10.7,6.1 10.7,3.3 13.43,3.3 U6.3 | R8.1 7.15,9.45 7.2,9.5
ODROID_TX_5V  (via drill 0.3, 0.6)
  Top 0.152: v8.1,25.4 8.1,25.5 7.1,25.5 U2.4 | v19.4,25.1 19.4,28.5 17.7,30 17.7,37.1 15.9,37.1 U4.9 | v2.9,17.1 v2.9,22.4
  Top 0.203: v42.8,46.6 v67.3,46.6 72.6,46.6 79.7,36.3 v79.7,32.2 79.7,26.6 82,24.3 82,7 81.1,6.1 78.1,6.1 73,1 v56.7,1 v40.3,1 v31.9,1
  Top 0.5: JD7.3 JD6.3
  Bottom 0.152: v19.4,25.1 7.9,25.1 7.85,25.15 v8.1,25.4 5.1,22.4 v2.9,22.4 | JD6.3 65.2,27.3 70.1,32.2 73.9,32.2 JD3.3
  Bottom 0.203: JD2.3 67.3,38.9 v67.3,46.6 | v42.8,46.6 42.75,46.5 JD1.3 | v56.7,1 56.7,9.05 JD4.3 | JD5.3 40.3,9.05 v40.3,1 | v31.9,1 13.5,1 12.9,0.4 2.8,0.4 arc-90 0.5,2.9 0.5,17.1 v2.9,17.1 | JD3.3 v79.7,32.2 73.95,32.2 JD3.3
SYS_SCL  (via drill 0.3)
  Top 0.152: U6.7 12.78,10.03 12.05,10.75 | 12.05,10.75 11.05,11.75 R10.1 10.35,14.3 6.6,14.3 6.6,16.7 U9.4 | 14.7,16.7 U8.4 | v14.7,14.3 14.7,16.7 | v11.2,32.3 8.8,34.7 8.8,40.1 8.5,40.4 U4.19 | v14.8,28.7 16,27.5 16,27 17.1,25.9 17.1,23.2 14.5,20.6 14.5,16.9 14.7,16.7 | v11.9,10.6 12.05,10.75
  Bottom 0.152: 14.7,10.6 14.7,9.1 18.2,9.1 JI2C.3 | 14.7,10.6 v14.7,14.3 | v14.8,28.7 v11.2,32.3 | 14.7,10.6 v11.9,10.6
SYS_SDA  (via drill 0.3)
  Top 0.152: U6.6 13.43,10.82 R9.1 12.75,12.05 12,12.8 12,14.2 11.85,14.35 | 11.85,14.35 11.5,14.7 9.5,14.7 U9.6 | 14.95,13.75 14.9,13.7 13.5,13.7 13.5,14.3 13.4,14.4 11.9,14.4 11.85,14.35 | 14.95,13.75 15.8,14.6 15.8,15.4 16.2,15.8 U8.6 | v8,39.2 8,40.2 7.8,40.4 U4.20 | v18.3,34.7 19.1,33.9 20,33.9 20,13.5 19.1,13.5 19,13.4 16.4,13.4 | 16.4,13.4 15,13.4 15,13.7 14.95,13.75 | 16.4,13.4 16.4,8.4 18.2,6.6 JI2C.2
  Bottom 0.152: v8,39.2 12.5,34.7 v18.3,34.7
VCCIO
  Top 0.152: J4.2 4.7,13.5 5.55,12.65 | 5.55,12.65 7.6,10.6 8.9,10.6 8.9,9.45 | 8.9,9.45 8.9,7.9 9.45,7.9 R7.2 11.5,7.3 11.5,5.1 12.12,5.1 U6.1 | 8.9,9.45 R8.2 | 9.7,23.7 11.3,23.7 C1.1 | U1.6 5.6,25.5 5.9,25.5 6.4,25 6.4,24.6 U2.5 7.4,24.6 7.9,24.1 7.9,23.7 | 7.9,23.7 9.7,23.7 | 9.7,23.7 U2.1 | 7.9,23.7 7.9,20 5.6,17.7 5.6,12.7 5.55,12.65

### Text on the board
tPlace: 5V | TX | RX | GND | - | - | AGIT | AEG | LAS | GND | USB | + | + | J4 | G | SCL | SDA | jjp@pobox.com | 3.3V | (c) 2015 | mjmech v1